# EAGLE schematic SolenoidWiring (EAGLE 7.6.0)
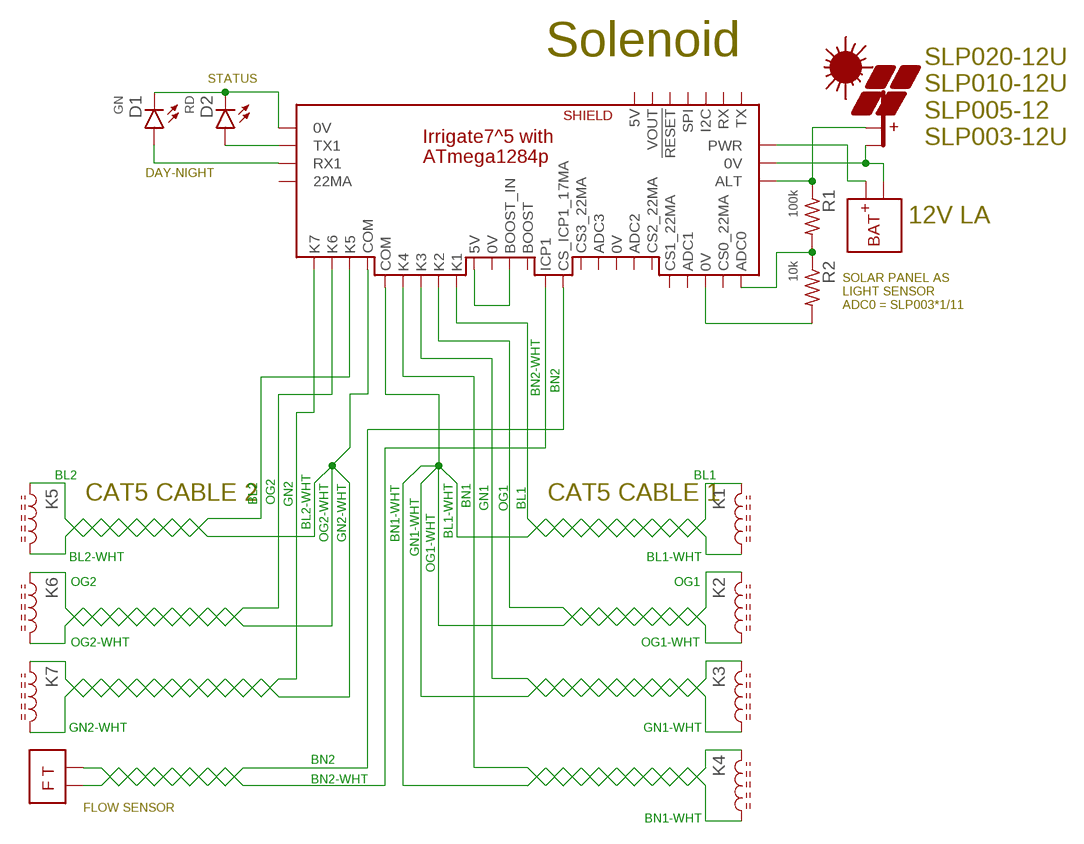
[diagram p0: schematic, sheet 1]

## Parts
D1  GN  LED5MM  [LED5MM]
D2  RD  LED5MM  [LED5MM]
K1  L0805  [C0805(2012)]
K2  L0805  [C0805(2012)]
K3  L0805  [C0805(2012)]
K4  L0805  [C0805(2012)]
K5  L0805  [C0805(2012)]
K6  L0805  [C0805(2012)]
K7  L0805  [C0805(2012)]
PV4  PV  [NA-30]
R1  100k  R0805  [C0805(2012)]
R2  10k  R0805  [C0805(2012)]
U$1  IRRIGATE7  [WITH_RPU_NAMES]
U$3  FT  [NA-30]
U$7  BAT  [NA-30]

## Nets
0V: PV4.2(-PV) U$1.0V@PWR(0V) U$7.2(-BAT)
BL1: K1.1 U$1.K1
BL1-WHT: K1.2
BL2: K5.1 U$1.K5
BL2-WHT: K5.2
BN1: K4.1 U$1.K4
BN1-WHT: K4.2
BN2: U$1.17MA@ICP1(CS_ICP1_17MA) U$3.2(PWR)
BN2-WHT: U$1.ICP1 U$3.1(PL)
GN1: K3.1 U$1.K3
GN1-WHT: K3.2
GN2: K7.1 U$1.K7
GN2-WHT: K7.2
N$1: U$1.PWR U$7.1(+BAT)
N$2: R2.2 U$1.0V@ADC2(0V)
N$3: D1.K D2.K U$1.17MA@ICP3(0V)
N$22: R1.2 R2.1 U$1.ADC0
N$25: U$1.COM@K4(COM)
N$26: U$1.COM@K5(COM)
N$27: U$1.5V U$1.BOOST_IN
N$28: D2.A U$1.DIO3(TX1)
N$29: D1.A U$1.DIO2(RX1)
N$34: PV4.1(+PV) R1.1 U$1.AUX(ALT)
OG1: K2.1 U$1.K2
OG1-WHT: K2.2
OG2: K6.1 U$1.K6
OG2-WHT: K6.2
Unconnected: U$1.0V U$1.22MA@ADC0(CS0_22MA) U$1.22MA@ADC1(CS1_22MA) U$1.22MA@ADC4(CS2_22MA) U$1.22MA@ADC5(CS3_22MA) U$1.22MA@DIO2(22MA) U$1.!RESET U$1.ADC1 U$1.ADC4(ADC2) U$1.ADC5(ADC3) U$1.BOOST U$1.I2C U$1.ICP3(0V) U$1.RX U$1.SHLD_5V(5V) U$1.SHLD_VOUT(VOUT) U$1.SPI U$1.TX

## Notes on the sheet
- Solenoid
- STATUS
- SLP020-12U
  SLP010-12U
  SLP005-12
  SLP003-12U
- DAY-NIGHT
- 12V LA
- SOLAR PANEL AS
  LIGHT SENSOR
  ADC0 = SLP003*1/11
- CAT5 CABLE 2 | CAT5 CABLE 1
- FLOW SENSOR

## Library data of the parts
D1 D2 = D-LED:LED: LED 120120WH [CREE,XHGAWT-00-0000-00000HXE1] LED WHITE 6500K 150LUM-W120120
K1-K7 = L-PWR:L: Inductor
PV4 = Documentation:PV
R1 R2 = R-C:R: Resiistor American-style symbol
U$1 = Documentation:IRRIGATE7: BM /w 1284p
U$3 = Documentation:FT
U$7 = Documentation:BAT